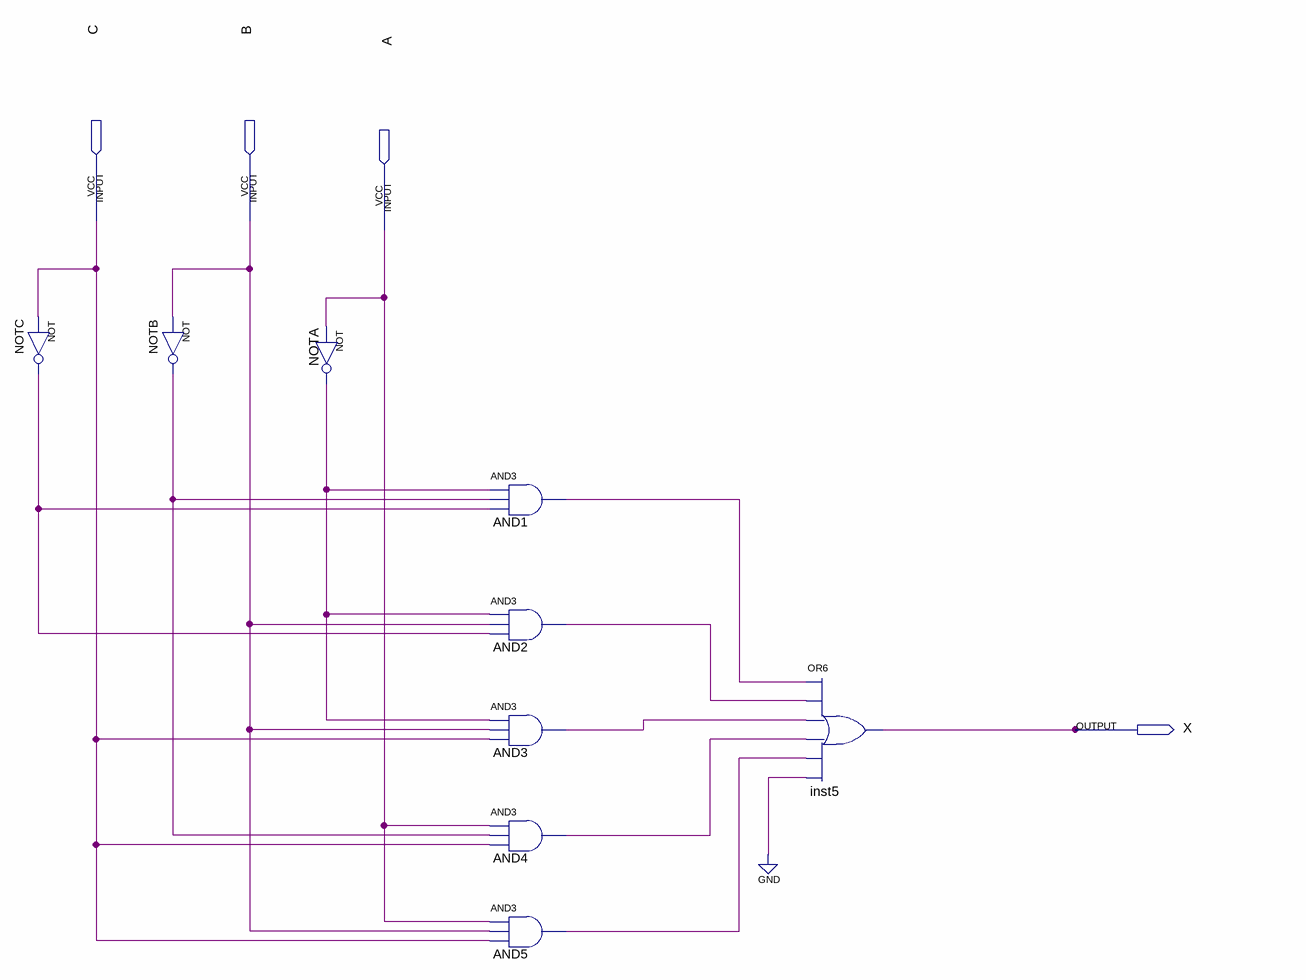
[diagram p0: schematic sheet]
// Quartus schematic Lab7SOP.bdf as structural Verilog: 9 symbols, 4 pins
module Lab7SOP (
  input  C,
  input  B,
  input  A,
  output X
);

  wire AND1_out, AND2_out, AND3_out, AND4_out, AND5_out, NOTA_out, NOTB_out, NOTC_out;

  not NOTC (NOTC_out, C);
  not NOTB (NOTB_out, B);
  not NOTA (NOTA_out, A);
  and AND1 (AND1_out, NOTA_out, NOTB_out, NOTC_out);
  and AND2 (AND2_out, NOTA_out, B, NOTC_out);
  and AND3 (AND3_out, NOTA_out, B, C);
  and AND4 (AND4_out, A, NOTB_out, C);
  and AND5 (AND5_out, A, B, C);
  or inst5 (X, AND1_out, AND2_out, AND3_out, AND4_out, AND5_out, 1'b0);
endmodule
